# Altium schematic sheet micro-ATMEGA32M1.SchDoc: ATMega32M1
size A4; DrawnBy: Dylan Vogel; Organization: UTAT SS; Revision: 1.1
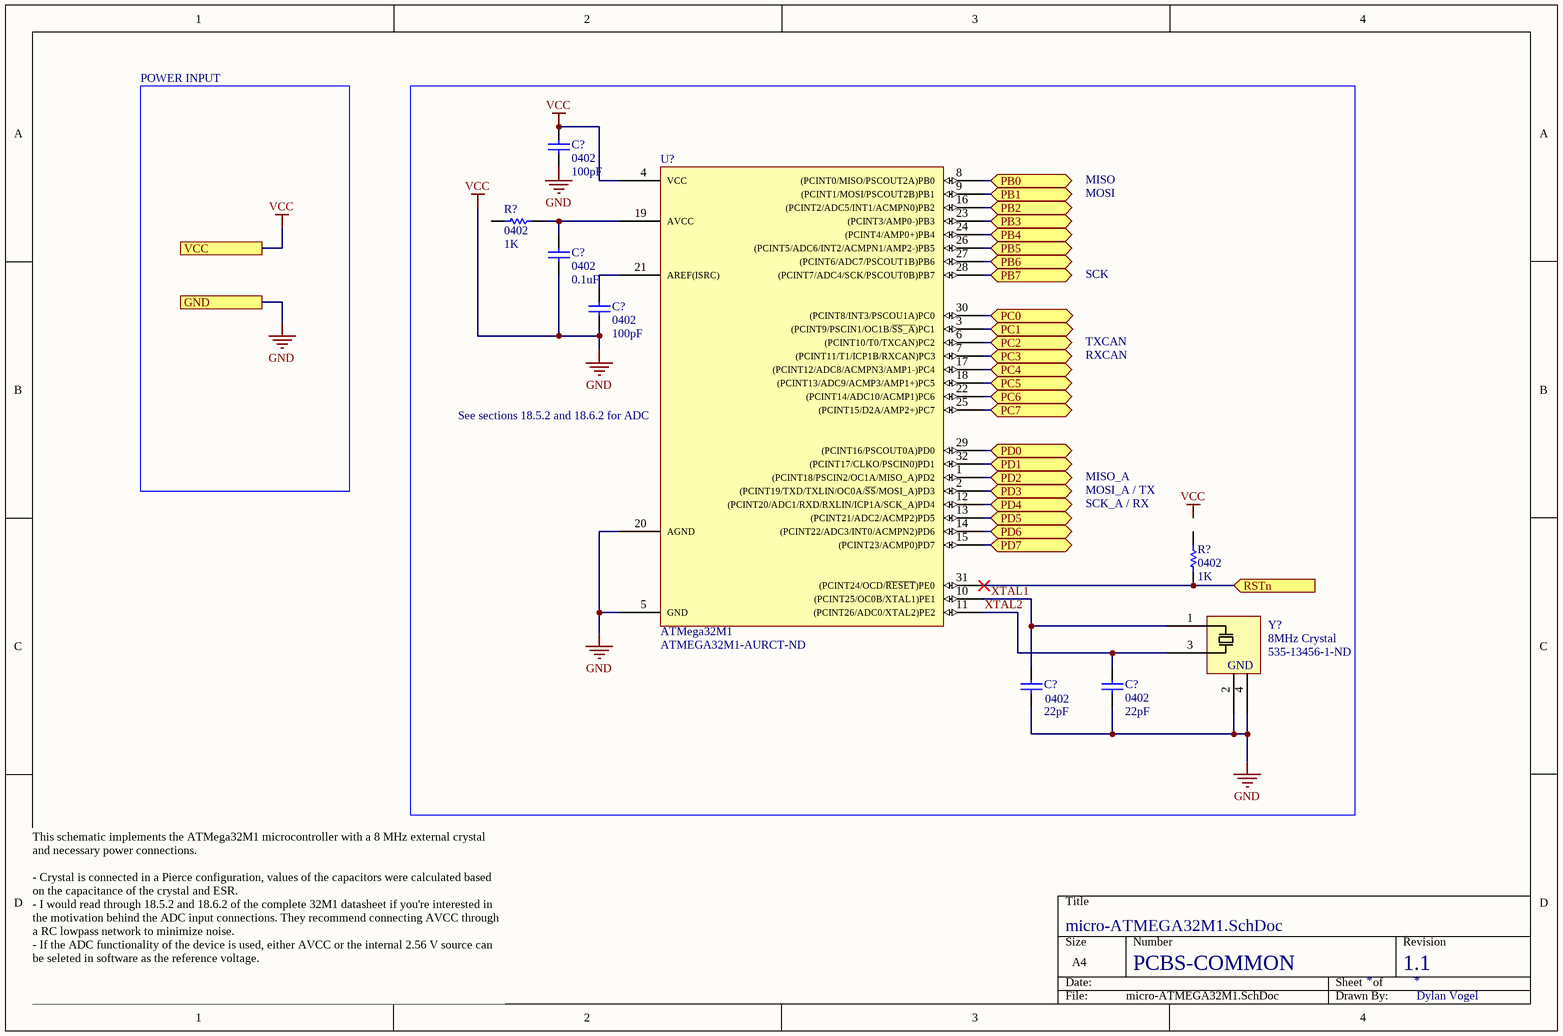
[diagram p0: micro-ATMEGA32M1.SchDoc]

## Parts
(Parts that share a designator on the sheet are numbered #1, #2 ... from top to bottom, then left to right.)
C?#1  0402  value 100pF  [RAD-0.3]
C?#2  0402  value 0.1uF  [RAD-0.3]
C?#3  0402  value 100pF  [RAD-0.3]
C?#4  0402  value 22pF  [CAP0402R]
C?#5  0402  value 22pF  [CAP0402R]
R?#1  0402  value 1K  [AXIAL-0.3]
R?#2  0402  value 1K  [AXIAL-0.3]
U?  ATMega32M1  Supplier Part Number 1: ATMEGA32M1-AURCT-ND  [QFP80P900X900X120-32]
Y?  8MHz Crystal  Supplier Part Number 1: 535-13456-1-ND  [OSCSC500X320X110-4N]

## Ports
GND, PB0 (bidir), PB1 (bidir), PB2 (bidir), PB3 (bidir), PB4 (bidir), PB5 (bidir), PB6 (bidir), PB7 (bidir), PC0 (bidir), PC1 (bidir), PC2 (bidir), PC3 (bidir), PC4 (bidir), PC5 (bidir), PC6 (bidir), PC7 (bidir), PD0 (bidir), PD1 (bidir), PD2 (bidir), PD3 (bidir), PD4 (bidir), PD5 (bidir), PD6 (bidir), PD7 (bidir), RSTn (in), VCC

## Nets
GND: C?#1.1 C?#1.2 C?#2.1 C?#3.2 C?#4.1 C?#5.1 U?.4(VCC) U?.5(GND) U?.20(AGND) Y?.2 Y?.4 ; port VCC, port GND  [also labelled VCC]
PB0: U?.8((PCINT0/MISO/PSCOUT2A)PB0) ; port PB0
PB1: U?.9((PCINT1/MOSI/PSCOUT2B)PB1) ; port PB1
PB2: U?.16((PCINT2/ADC5/INT1/ACMPN0)PB2) ; port PB2
PB3: U?.23((PCINT3/AMP0-)PB3) ; port PB3
PB4: U?.24((PCINT4/AMP0+)PB4) ; port PB4
PB5: U?.26((PCINT5/ADC6/INT2/ACMPN1/AMP2-)PB5) ; port PB5
PB6: U?.27((PCINT6/ADC7/PSCOUT1B)PB6) ; port PB6
PB7: U?.28((PCINT7/ADC4/SCK/PSCOUT0B)PB7) ; port PB7
PC0: U?.30((PCINT8/INT3/PSCOU1A)PC0) ; port PC0
PC1: U?.3((PCINT9/PSCIN1/OC1B/~{SS_A})PC1) ; port PC1
PC2: U?.6((PCINT10/T0/TXCAN)PC2) ; port PC2
PC3: U?.7((PCINT11/T1/ICP1B/RXCAN)PC3) ; port PC3
PC4: U?.17((PCINT12/ADC8/ACMPN3/AMP1-)PC4) ; port PC4
PC5: U?.18((PCINT13/ADC9/ACMP3/AMP1+)PC5) ; port PC5
PC6: U?.22((PCINT14/ADC10/ACMP1)PC6) ; port PC6
PC7: U?.25((PCINT15/D2A/AMP2+)PC7) ; port PC7
PD0: U?.29((PCINT16/PSCOUT0A)PD0) ; port PD0
PD1: U?.32((PCINT17/CLKO/PSCIN0)PD1) ; port PD1
PD2: U?.1((PCINT18/PSCIN2/OC1A/MISO_A)PD2) ; port PD2
PD3: U?.2((PCINT19/TXD/TXLIN/OC0A/~{SS}/MOSI_A)PD3) ; port PD3
PD4: U?.12((PCINT20/ADC1/RXD/RXLIN/ICP1A/SCK_A)PD4) ; port PD4
PD5: U?.13((PCINT21/ADC2/ACMP2)PD5) ; port PD5
PD6: U?.14((PCINT22/ADC3/INT0/ACMPN2)PD6) ; port PD6
PD7: U?.15((PCINT23/ACMP0)PD7) ; port PD7
RSTn: R?#2.1 U?.31((PCINT24/OCD/~{RESET})PE0) ; port RSTn
XTAL1: C?#4.2 U?.10((PCINT25/OC0B/XTAL1)PE1) Y?.1(IN)
XTAL2: C?#5.2 U?.11((PCINT26/ADC0/XTAL2)PE2) Y?.3(IN)
NetC?#2_2: C?#2.2 R?#1.1 U?.19(AVCC)
NetC?#3_1: C?#3.1 U?.21(AREF(ISRC))

Not connected (* = marked no-connect by the designer): R?#1 2; R?#2 2

## Notes on the sheet
- POWER INPUT
- MOSI
- MISO
- SCK
- TXCAN
- RXCAN
- (near U?) See sections 18.5.2 and 18.6.2 for ADC
- MOSI_A / TX
- MISO_A
- SCK_A / RX
- PCBS-COMMON
- This schematic implements the ATMega32M1 microcontroller with a 8 MHz external crystal and necessary power connections.
  - Crystal is connected in a Pierce configuration, values of the capacitors were calculated based on the capacitance of the crystal and ESR.
  - I would read through 18.5.2 and 18.6.2 of the complete 32M1 datasheet if you're interested in the motivation behind the ADC input connections. They recommend connecting AVCC through a RC lowpass network to minimize noise.
  - If the ADC functionality of the device is used, either AVCC or the internal 2.56 V source can be seleted in software as the reference voltage.
- Labels drawn without touching a wire or pin: VCC
- (in symbol AMB3B-8MHz) GND

## Library data of the parts
C?#1-C?#3 = Cap: Capacitor; Published: 8-Jun-2000; LatestRevisionDate: 17-Jul-2002; LatestRevisionNote: Re-released for DXP Platform.; PackageReference: RAD-0.3; Publisher: Altium Limited; PackageDescription: Radial Cap, Thru-Hole; 2 Leads; 0.3 in Pin Spacing
C?#4 C?#5 = Cap: Capacitor; Manufacturer: KEMET; Manufacturer Part Number: C0402C220K4RAC7867; Tolerance: 10%; Voltage Rating: 16V; Published: 8-Jun-2000; LatestRevisionDate: 17-Jul-2002; LatestRevisionNote: Re-released for DXP Platform.; PackageReference: RAD-0.3; Publisher: Altium Limited; PackageDescription: Radial Cap, Thru-Hole; 2 Leads; 0.3 in Pin Spacing; Supplier 1: Digi-Key; Supplier Part Number 1: 399-17554-1-ND; Stock 1: 72125; Pricing 1: 1=0.19, 10=0.132, 100=0.062, 500=0.0435, 1000=0.03601, 2500=0.03351, 5000=0.03066 (USD); Mount: Surface Mount; Case/Package: 0402; Case Code (Imperial): 0402; Case Code (Metric): 1005; Min Operating Temperature: -55°C; Max Operating Temperature: 125°C; Packaging: Tape and Reel; Capacitance: 22pF
R?#1 R?#2 = Res1: Resistor; Published: 8-Jun-2000; LatestRevisionDate: 17-Jul-2002; LatestRevisionNote: Re-released for DXP Platform.; PackageReference: AXIAL-0.3; Publisher: Altium Limited; PackageDescription: Axial Device, Thru-Hole; 2 Leads; 0.3 in Pin Spacing
U? = ATMega32M1: Atmel 8-bit AVR microcontroller.; Supplier 1: Digi-Key
Y? = AMB3B-8MHz: 8MHz Abracom 4-pin crystal.; Supplier 1: Digi-Key